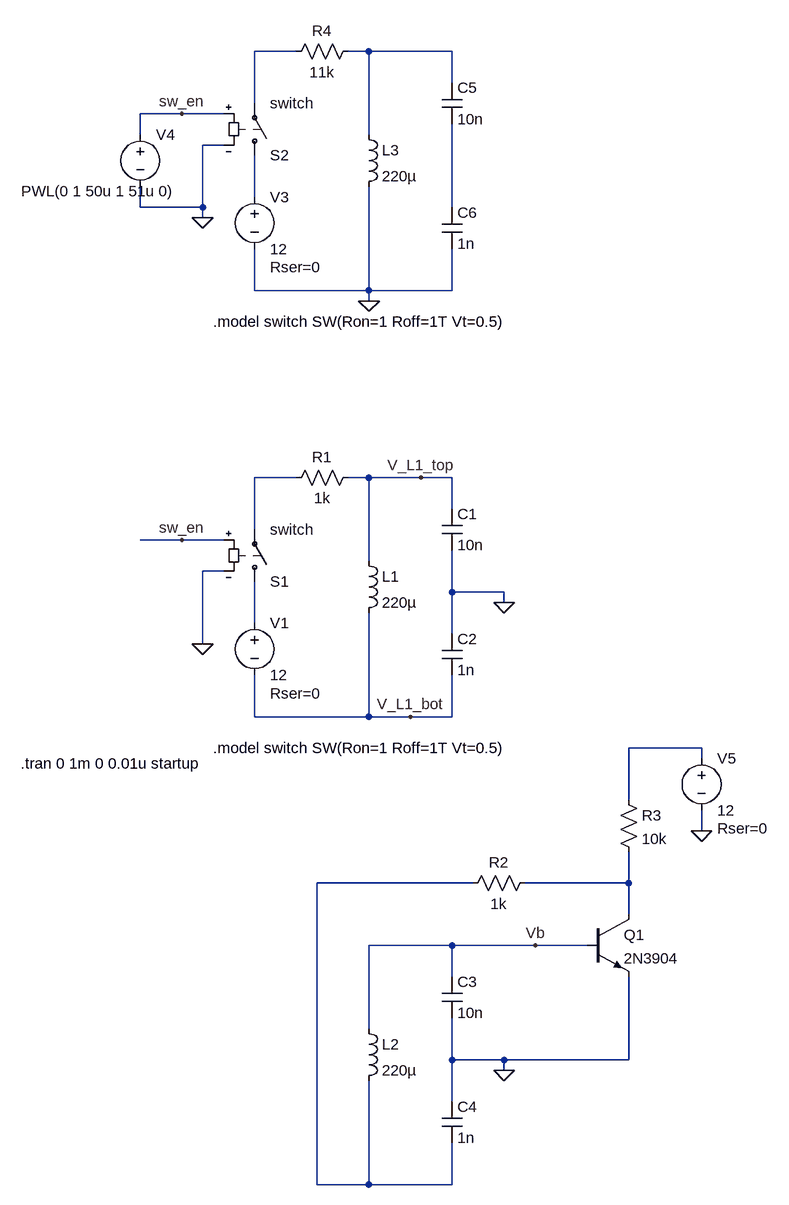
[diagram p0: schematic basic_colpitts_falstad_buildup.asc]
basic_colpitts_falstad_buildup.asc, the LTspice schematic file:
Version 4
SHEET 1 880 1112
WIRE -80 -640 -144 -640
WIRE 32 -640 0 -640
WIRE 160 -640 32 -640
WIRE 160 -592 160 -640
WIRE -144 -560 -144 -640
WIRE -256 -544 -320 -544
WIRE -192 -544 -256 -544
WIRE -320 -512 -320 -544
WIRE 32 -512 32 -640
WIRE -192 -496 -224 -496
WIRE -144 -416 -144 -480
WIRE -320 -400 -320 -432
WIRE -224 -400 -224 -496
WIRE -224 -400 -320 -400
WIRE 160 -400 160 -528
WIRE -224 -384 -224 -400
WIRE -144 -272 -144 -336
WIRE 32 -272 32 -432
WIRE 32 -272 -144 -272
WIRE 160 -272 160 -336
WIRE 160 -272 32 -272
WIRE 32 -256 32 -272
WIRE -80 16 -144 16
WIRE 32 16 0 16
WIRE 112 16 32 16
WIRE 160 16 112 16
WIRE 160 64 160 16
WIRE -144 96 -144 16
WIRE -256 112 -320 112
WIRE -192 112 -256 112
WIRE 32 144 32 16
WIRE -192 160 -224 160
WIRE 160 192 160 128
WIRE 240 192 160 192
WIRE 240 208 240 192
WIRE -144 240 -144 176
WIRE 160 256 160 192
WIRE -224 272 -224 160
WIRE -144 384 -144 320
WIRE 32 384 32 224
WIRE 32 384 -144 384
WIRE 96 384 32 384
WIRE 160 384 160 320
WIRE 160 384 96 384
WIRE 544 432 432 432
WIRE 544 448 544 432
WIRE 432 512 432 432
WIRE 544 560 544 528
WIRE 192 640 -48 640
WIRE 432 640 432 592
WIRE 432 640 272 640
WIRE 432 688 432 640
WIRE 160 736 32 736
WIRE 288 736 160 736
WIRE 368 736 288 736
WIRE 160 784 160 736
WIRE 32 864 32 736
WIRE 160 912 160 848
WIRE 240 912 160 912
WIRE 432 912 432 784
WIRE 432 912 240 912
WIRE 240 928 240 912
WIRE 160 976 160 912
WIRE -48 1104 -48 640
WIRE 32 1104 32 944
WIRE 32 1104 -48 1104
WIRE 160 1104 160 1040
WIRE 160 1104 32 1104
FLAG 240 208 0
FLAG -224 272 0
FLAG 240 928 0
FLAG 32 -256 0
FLAG -224 -384 0
FLAG 544 560 0
FLAG -256 -544 sw_en
FLAG -256 112 sw_en
FLAG 112 16 V_L1_top
FLAG 96 384 V_L1_bot
FLAG 288 736 Vb
SYMBOL ind 16 128 R0
SYMATTR InstName L1
SYMATTR Value 220µ
SYMATTR SpiceLine Rser=0
SYMBOL cap 144 64 R0
SYMATTR InstName C1
SYMATTR Value 10n
SYMATTR SpiceLine Rser=0
SYMBOL cap 144 256 R0
SYMATTR InstName C2
SYMATTR Value 1n
SYMATTR SpiceLine Rser=0
SYMBOL res 16 0 R90
WINDOW 0 0 56 VBottom 2
WINDOW 3 32 56 VTop 2
SYMATTR InstName R1
SYMATTR Value 1k
SYMBOL voltage -144 224 R0
WINDOW 123 0 0 Left 0
WINDOW 39 24 124 Left 2
SYMATTR InstName V1
SYMATTR Value 12
SYMATTR SpiceLine Rser=0
SYMBOL sw -144 192 M180
SYMATTR InstName S1
SYMATTR Value switch
SYMBOL ind 16 848 R0
SYMATTR InstName L2
SYMATTR Value 220µ
SYMATTR SpiceLine Rser=1
SYMBOL cap 144 784 R0
SYMATTR InstName C3
SYMATTR Value 10n
SYMATTR SpiceLine Rser=0
SYMBOL cap 144 976 R0
SYMATTR InstName C4
SYMATTR Value 1n
SYMATTR SpiceLine Rser=0
SYMBOL npn 368 688 R0
SYMATTR InstName Q1
SYMATTR Value 2N3904
SYMBOL res 288 624 R90
WINDOW 0 0 56 VBottom 2
WINDOW 3 32 56 VTop 2
SYMATTR InstName R2
SYMATTR Value 1k
SYMBOL res 416 496 R0
SYMATTR InstName R3
SYMATTR Value 10k
SYMBOL ind 16 -528 R0
SYMATTR InstName L3
SYMATTR Value 220µ
SYMATTR SpiceLine Rser=0
SYMBOL cap 144 -592 R0
SYMATTR InstName C5
SYMATTR Value 10n
SYMATTR SpiceLine Rser=0
SYMBOL cap 144 -400 R0
SYMATTR InstName C6
SYMATTR Value 1n
SYMATTR SpiceLine Rser=0
SYMBOL res 16 -656 R90
WINDOW 0 0 56 VBottom 2
WINDOW 3 32 56 VTop 2
SYMATTR InstName R4
SYMATTR Value 11k
SYMBOL voltage -144 -432 R0
WINDOW 123 0 0 Left 0
WINDOW 39 24 124 Left 2
SYMATTR InstName V3
SYMATTR Value 12
SYMATTR SpiceLine Rser=0
SYMBOL sw -144 -464 M180
SYMATTR InstName S2
SYMATTR Value switch
SYMBOL voltage -320 -528 R0
WINDOW 3 -183 103 Left 2
WINDOW 123 0 0 Left 0
WINDOW 39 0 0 Left 0
SYMATTR InstName V4
SYMATTR Value PWL(0 1 50u 1 51u 0)
SYMBOL voltage 544 432 R0
WINDOW 123 0 0 Left 0
WINDOW 39 24 124 Left 2
SYMATTR InstName V5
SYMATTR Value 12
SYMATTR SpiceLine Rser=0
TEXT -208 432 Left 2 !.model switch SW(Ron=1 Roff=1T Vt=0.5)
TEXT -504 456 Left 2 !.tran 0 1m 0 0.01u startup
TEXT -208 -224 Left 2 !.model switch SW(Ron=1 Roff=1T Vt=0.5)

The netlist it stands for:
* basic_colpitts_falstad_buildup.asc
L1 V_L1_top V_L1_bot 220µ Rser=0
C1 V_L1_top 0 10n Rser=0
C2 0 V_L1_bot 1n Rser=0
R1 V_L1_top N005 1k
V1 N006 V_L1_bot 12 Rser=0
S1 N006 N005 sw_en 0 switch
L2 Vb N008 220µ Rser=1
C3 Vb 0 10n Rser=0
C4 0 N008 1n Rser=0
Q1 N009 Vb 0 0 2N3904
R2 N009 N008 1k
R3 N007 N009 10k
L3 N002 0 220µ Rser=0
C5 N002 N004 10n Rser=0
C6 N004 0 1n Rser=0
R4 N002 N001 11k
V3 N003 0 12 Rser=0
S2 N003 N001 sw_en 0 switch
V4 sw_en 0 PWL(0 1 50u 1 51u 0)
V5 N007 0 12 Rser=0
.model NPN NPN
.model PNP PNP
.lib standard.bjt
.model switch SW(Ron=1 Roff=1T Vt=0.5)
.tran 0 1m 0 0.01u startup
.model switch SW(Ron=1 Roff=1T Vt=0.5)
.backanno
.end